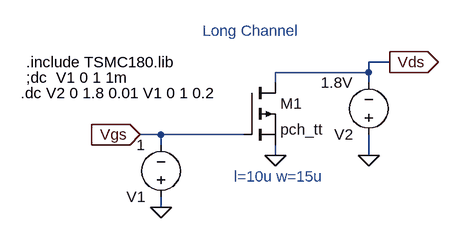
[diagram p0: schematic Prob_4b4.asc]
Prob_4b4.asc, the LTspice schematic file:
Version 4
SHEET 1 880 680
WIRE 544 48 512 48
WIRE 512 64 512 48
WIRE 512 64 368 64
WIRE 368 80 368 64
WIRE 512 80 512 64
WIRE 192 160 160 160
WIRE 320 160 192 160
WIRE 192 176 192 160
WIRE 368 192 368 176
WIRE 512 192 512 160
WIRE 192 272 192 256
FLAG 192 272 0
FLAG 368 192 0
FLAG 512 192 0
FLAG 160 160 Vgs
IOPIN 160 160 In
FLAG 544 48 Vds
IOPIN 544 48 Out
SYMBOL voltage 192 272 R180
WINDOW 123 0 0 Left 0
WINDOW 39 0 0 Left 0
SYMATTR InstName V1
SYMATTR Value 1
SYMBOL voltage 512 176 R180
WINDOW 123 0 0 Left 0
WINDOW 39 0 0 Left 0
SYMATTR InstName V2
SYMATTR Value 1.8V
SYMBOL pmos 320 80 R0
SYMATTR InstName M1
SYMATTR Value pch_tt
SYMATTR Value2 l=10u w=15u
TEXT -16 48 Left 2 !.include TSMC180.lib
TEXT -24 96 Left 2 !.dc V2 0 1.8 0.01 V1 0 1 0.2
TEXT -16 72 Left 2 !;dc  V1 0 1 1m
TEXT 256 0 Left 2 ;Long Channel
TEXT 304 224 Left 2 ;l=10u w=15u

The netlist it stands for:
* Prob_4b4.asc
V1 0 Vgs 1
V2 0 Vds 1.8V
M1 Vds Vgs 0 0 pch_tt l=10u w=15u
.model NMOS NMOS
.model PMOS PMOS
.lib standard.mos
.include TSMC180.lib
.dc V2 0 1.8 0.01 V1 0 1 0.2
;dc  V1 0 1 1m
* Long Channel
* l=10u w=15u
.backanno
.end